# EAGLE design atmega328_tlc5940 (EAGLE 6.4)
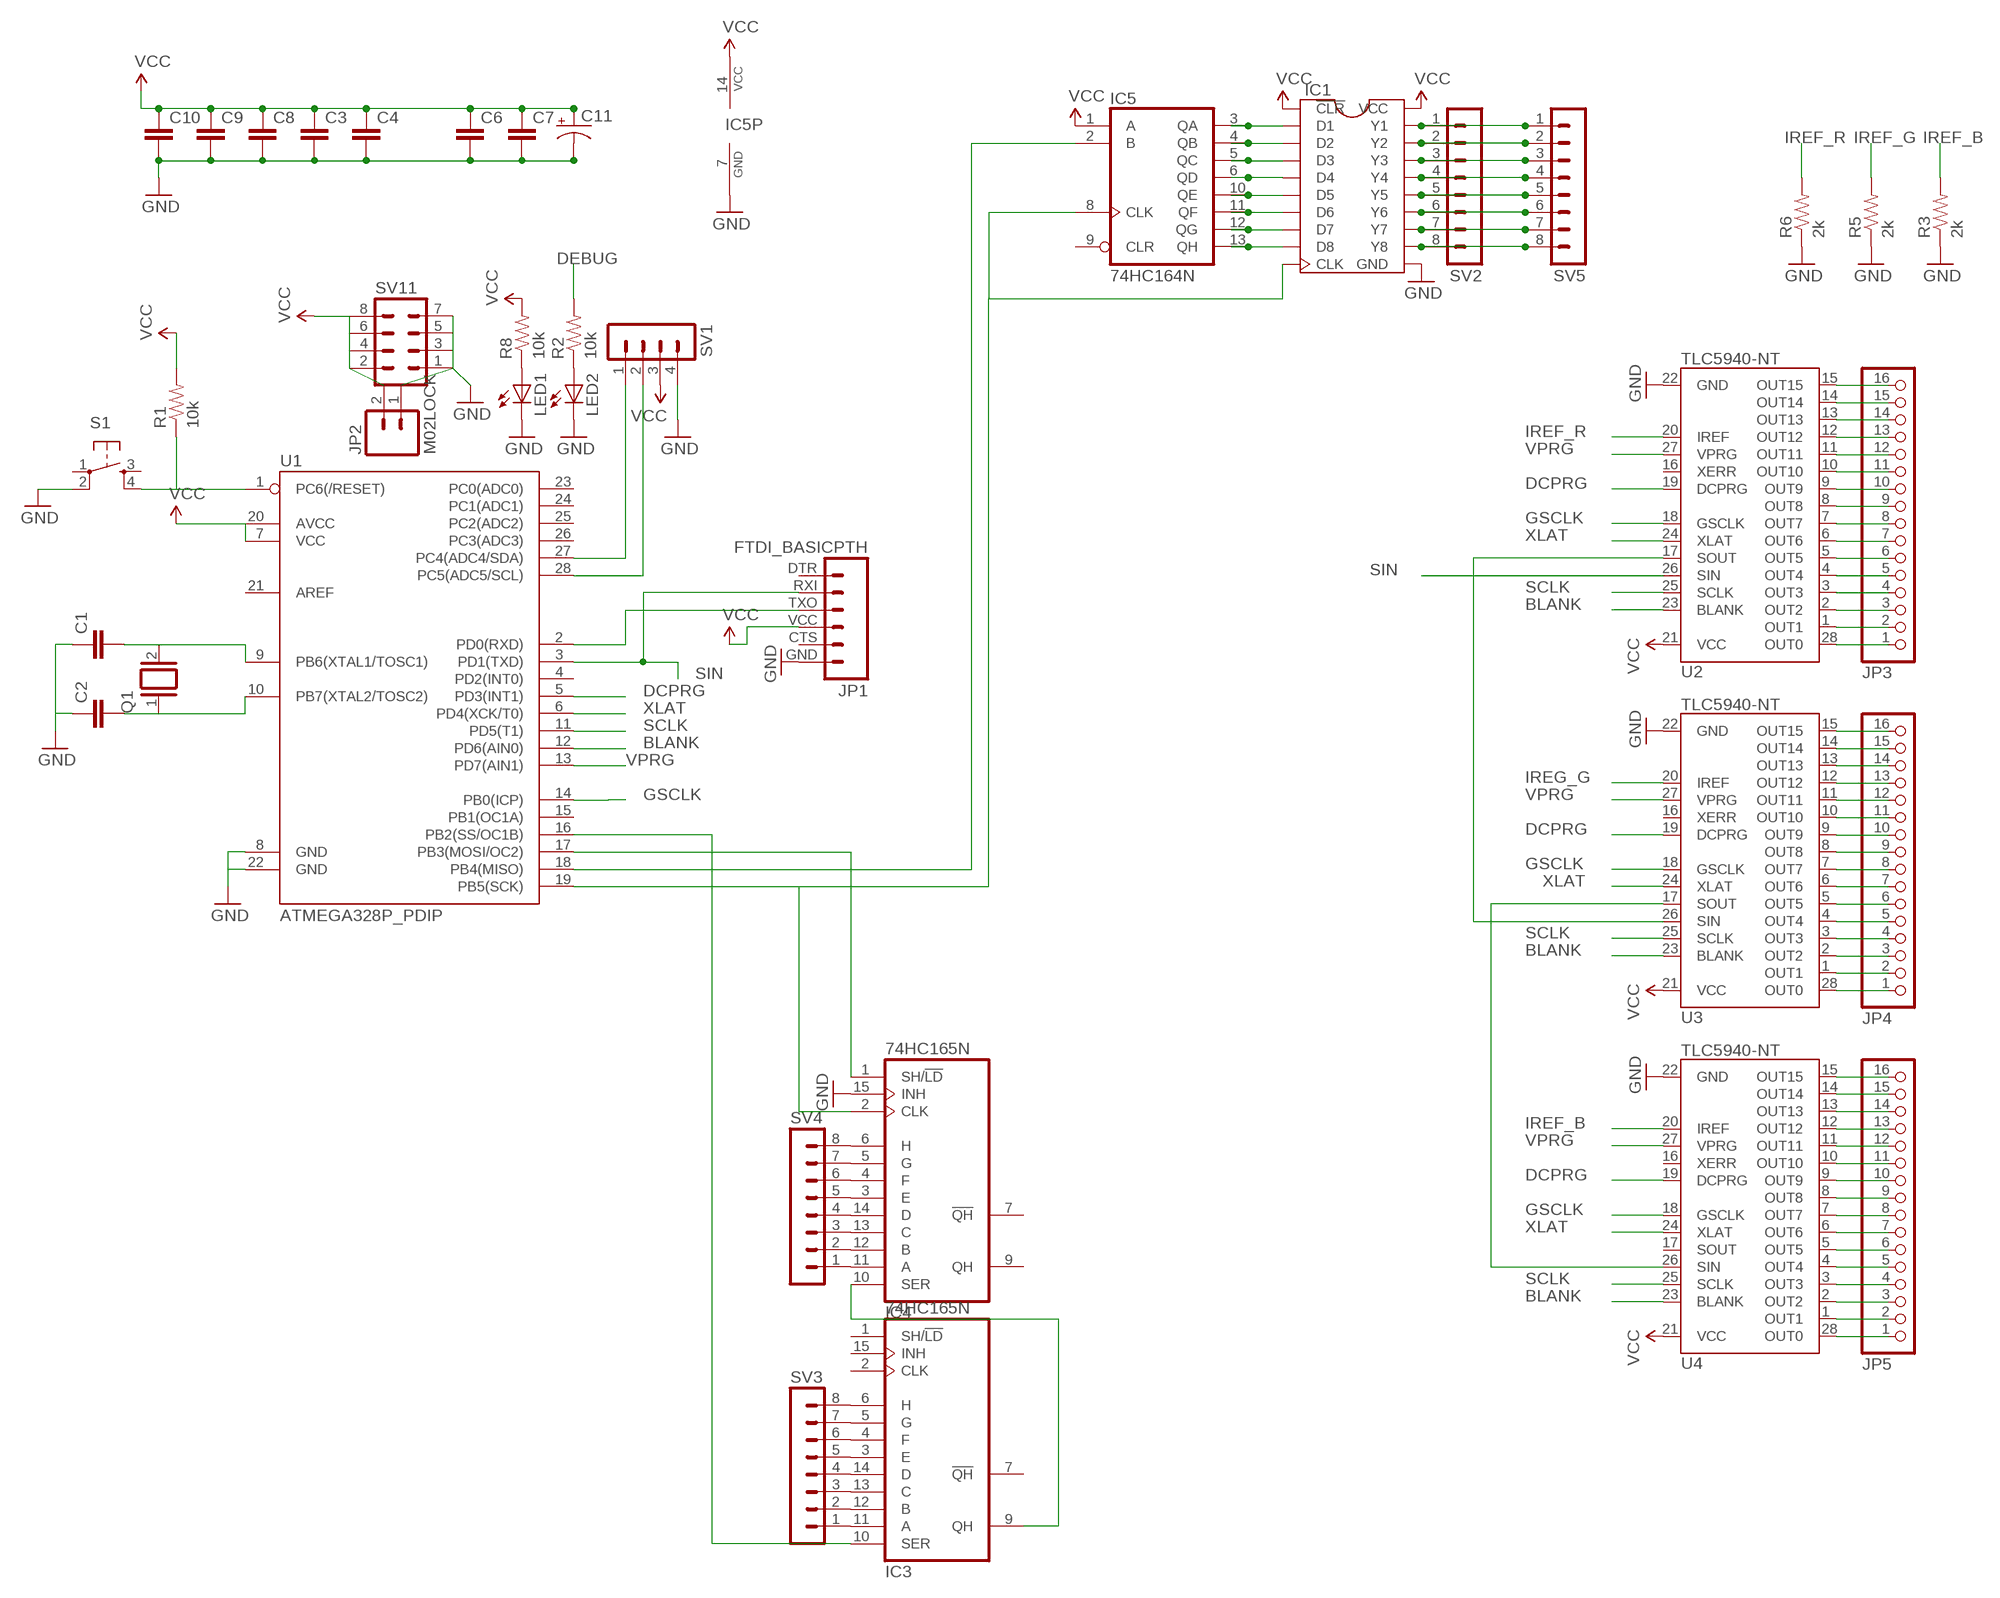
[diagram p0: schematic, sheet 1]

## Parts
C1  CAPEZ  [CAP-PTH-SMALLEZ]
C2  CAPEZ  [CAP-PTH-SMALLEZ]
C3  CAPEZ  [CAP-PTH-SMALLEZ]
C4  CAPEZ  [CAP-PTH-SMALLEZ]
C6  CAPEZ  [CAP-PTH-SMALLEZ]
C7  CAPEZ  [CAP-PTH-SMALLEZ]
C8  CAPEZ  [CAP-PTH-SMALLEZ]
C9  CAPEZ  [CAP-PTH-SMALLEZ]
C10  CAPEZ  [CAP-PTH-SMALLEZ]
C11  CPOL-USE3.5-8  [E3,5-8]
IC1  IC-PACKAGE_DIL20S  [IC-PACKAGE_SOCKET-20]
IC3  74HC165N  [DIL16]
IC4  74HC165N  [DIL16]
IC5  74HC164N  [DIL14]
JP1  FTDI_BASICPTH  [FTDI_BASIC]
JP2  M02LOCK  [1X02_LOCK]
JP3  PINHD-1X16  [1X16]
JP4  PINHD-1X16  [1X16]
JP5  PINHD-1X16  [1X16]
LED1  LED5MM  [LED5MM]
LED2  LED5MM  [LED5MM]
Q1  XTAL/S  [QS]
R1  10k  RESISTORKIT  [AXIAL-0.3-KIT]
R2  10k  RESISTORKIT  [AXIAL-0.3-KIT]
R3  2k  RESISTORKIT  [AXIAL-0.3-KIT]
R5  2k  RESISTORKIT  [AXIAL-0.3-KIT]
R6  2k  RESISTORKIT  [AXIAL-0.3-KIT]
R8  10k  RESISTORKIT  [AXIAL-0.3-KIT]
S1  TAC_SWITCHPTH  [TACTILE-PTH]
SV1  MA04-1  [MA04-1]
SV2  MA08-1  [MA08-1]
SV3  MA08-1  [MA08-1]
SV4  MA08-1  [MA08-1]
SV5  MA08-1  [MA08-1]
SV11  MA04-2  [MA04-2]
U1  ATMEGA328P_PDIP  [DIL28-3]
U2  TLC5940-NT  [DIL28-3]
U3  TLC5940-NT  [DIL28-3]
U4  TLC5940-NT  [DIL28-3]

## Nets
BLANK: U1.12(PD6(AIN0)) U2.23(BLANK) U3.23(BLANK) U4.23(BLANK)
DCPRG: U1.5(PD3(INT1)) U2.19(DCPRG) U3.19(DCPRG) U4.19(DCPRG)
DEBUG: R2.P$2
GND: C1.1 C2.1 C3.2 C4.2 C6.2 C7.2 C8.2 C9.2 C10.2 C11.- IC1.11(GND) IC4.15(INH) IC5.7(GND) JP1.GND JP2.1 LED1.K(C) LED2.K(C) R3.P$1 R5.P$1 R6.P$1 S1.2 SV1.4 SV11.1 SV11.3 SV11.5 SV11.7 U1.8(GND) U1.22(GND) U2.22(GND) U3.22(GND) U4.22(GND)
GSCLK: U1.14(PB0(ICP)) U2.18(GSCLK) U3.18(GSCLK) U4.18(GSCLK)
IREF_B: R3.P$2 U4.20(IREF)
IREF_G: R5.P$2
IREF_R: R6.P$2 U2.20(IREF)
IREG_G: U3.20(IREF)
N$1: R1.P$1 S1.4 U1.1(PC6(/RESET))
N$2: C1.2 Q1.2 U1.9(PB6(XTAL1/TOSC1))
N$3: C2.2 Q1.1 U1.10(PB7(XTAL2/TOSC2))
N$4: JP3.16 U2.15(OUT15)
N$5: JP3.15 U2.14(OUT14)
N$6: JP3.14 U2.13(OUT13)
N$7: JP3.13 U2.12(OUT12)
N$8: JP3.12 U2.11(OUT11)
N$9: JP3.11 U2.10(OUT10)
N$10: JP3.10 U2.9(OUT9)
N$11: JP3.9 U2.8(OUT8)
N$12: JP3.8 U2.7(OUT7)
N$13: JP3.7 U2.6(OUT6)
N$14: JP3.6 U2.5(OUT5)
N$15: JP3.5 U2.4(OUT4)
N$16: JP3.4 U2.3(OUT3)
N$17: JP3.3 U2.2(OUT2)
N$18: JP3.2 U2.1(OUT1)
N$19: JP3.1 U2.28(OUT0)
N$20: JP4.16 U3.15(OUT15)
N$21: JP4.15 U3.14(OUT14)
N$22: JP4.14 U3.13(OUT13)
N$23: SV1.1 U1.27(PC4(ADC4/SDA))
N$24: JP4.13 U3.12(OUT12)
N$25: JP4.12 U3.11(OUT11)
N$26: JP4.11 U3.10(OUT10)
N$27: JP4.10 U3.9(OUT9)
N$28: JP4.9 U3.8(OUT8)
N$29: JP4.8 U3.7(OUT7)
N$30: JP4.7 U3.6(OUT6)
N$31: JP4.6 U3.5(OUT5)
N$32: JP4.5 U3.4(OUT4)
N$33: JP4.4 U3.3(OUT3)
N$34: JP4.3 U3.2(OUT2)
N$35: JP4.2 U3.1(OUT1)
N$36: JP4.1 U3.28(OUT0)
N$37: JP5.16 U4.15(OUT15)
N$38: JP5.15 U4.14(OUT14)
N$39: JP5.14 U4.13(OUT13)
N$40: JP5.13 U4.12(OUT12)
N$41: JP5.12 U4.11(OUT11)
N$42: JP5.11 U4.10(OUT10)
N$43: JP5.10 U4.9(OUT9)
N$44: JP5.9 U4.8(OUT8)
N$45: JP5.8 U4.7(OUT7)
N$46: JP5.7 U4.6(OUT6)
N$47: JP5.6 U4.5(OUT5)
N$48: JP5.5 U4.4(OUT4)
N$49: JP5.4 U4.3(OUT3)
N$50: JP5.3 U4.2(OUT2)
N$51: JP5.2 U4.1(OUT1)
N$52: JP5.1 U4.28(OUT0)
N$53: U2.17(SOUT) U3.26(SIN)
N$54: U3.17(SOUT) U4.26(SIN)
N$55: LED2.A R2.P$1
N$56: LED1.A R8.P$1
N$57: SV1.2 U1.28(PC5(ADC5/SCL))
N$58: IC1.2(D1) IC5.3(QA)
N$59: IC5.2(B) U1.18(PB4(MISO))
N$60: IC1.10(CLK) IC4.2(CLK) IC5.8(CLK) U1.19(PB5(SCK))
N$61: IC4.1(SH/!LD) U1.17(PB3(MOSI/OC2))
N$62: IC1.3(D2) IC5.4(QB)
N$63: IC1.4(D3) IC5.5(QC)
N$64: IC1.5(D4) IC5.6(QD)
N$65: IC1.6(D5) IC5.10(QE)
N$66: IC1.7(D6) IC5.11(QF)
N$67: IC1.8(D7) IC5.12(QG)
N$68: IC1.9(D8) IC5.13(QH)
N$69: IC3.9(QH) IC4.10(SER)
N$70: IC3.10(SER) U1.16(PB2(SS/OC1B))
N$72: IC1.19(Y1) SV2.1 SV5.1
N$73: IC1.18(Y2) SV2.2 SV5.2
N$74: IC1.17(Y3) SV2.3 SV5.3
N$75: IC1.16(Y4) SV2.4 SV5.4
N$76: IC1.15(Y5) SV2.5 SV5.5
N$77: IC1.14(Y6) SV2.6 SV5.6
N$78: IC1.13(Y7) SV2.7 SV5.7
N$79: IC1.12(Y8) SV2.8 SV5.8
N$80: IC3.11(A) SV3.1
N$81: IC3.12(B) SV3.2
N$82: IC3.13(C) SV3.3
N$83: IC3.14(D) SV3.4
N$84: IC3.3(E) SV3.5
N$85: IC3.4(F) SV3.6
N$86: IC3.5(G) SV3.7
N$87: IC3.6(H) SV3.8
N$88: IC4.11(A) SV4.1
N$89: IC4.12(B) SV4.2
N$90: IC4.13(C) SV4.3
N$91: IC4.14(D) SV4.4
N$92: IC4.3(E) SV4.5
N$93: IC4.4(F) SV4.6
N$94: IC4.5(G) SV4.7
N$95: IC4.6(H) SV4.8
RX$0: JP1.TXO U1.2(PD0(RXD))
SCLK: U1.11(PD5(T1)) U2.25(SCLK) U3.25(SCLK) U4.25(SCLK)
SIN: JP1.RXI U1.3(PD1(TXD)) U2.26(SIN)
VCC: C3.1 C4.1 C6.1 C7.1 C8.1 C9.1 C10.1 C11.+ IC1.1(!CLR) IC1.20(VCC) IC5.1(A) IC5.14(VCC) JP1.VCC JP2.2 R1.P$2 R8.P$2 SV1.3 SV11.2 SV11.4 SV11.6 SV11.8 U1.7(VCC) U1.20(AVCC) U2.21(VCC) U3.21(VCC) U4.21(VCC)
VPRG: U1.13(PD7(AIN1)) U2.27(VPRG) U3.27(VPRG) U4.27(VPRG)
XLAT: U1.6(PD4(XCK/T0)) U2.24(XLAT) U3.24(XLAT) U4.24(XLAT)
Unconnected: IC3.1(SH/!LD) IC3.2(CLK) IC3.7(!QH) IC3.15(INH) IC4.7(!QH) IC4.9(QH) IC5.9(CLR) JP1.CTS JP1.DTR S1.1 S1.3 U1.4(PD2(INT0)) U1.15(PB1(OC1A)) U1.21(AREF) U1.23(PC0(ADC0)) U1.24(PC1(ADC1)) U1.25(PC2(ADC2)) U1.26(PC3(ADC3)) U2.16(XERR) U3.16(XERR) U4.16(XERR) U4.17(SOUT)

## Power pins joined to a net without a drawn wire
GND: IC3.8(GND) IC4.8(GND)
VCC: IC3.16(VCC) IC4.16(VCC)

## Library data of the parts
C1 C2 = SparkFun-Passives:CAP: Capacitor Standard 0603 ceramic capacitor, and 0.1" leaded capacitor.
C3 C4 C6-C10 = SparkFun-Capacitors:CAP: Capacitor Standard 0603 ceramic capacitor, and 0.1" leaded capacitor.
C11 = resistor:CPOL-US: POLARIZED CAPACITOR, American symbol
IC1 = TLC59213:IC-PACKAGE_DIL20: Dual In Line / Socket
IC3 IC4 = 74xx-eu:74*165: 8-bit parallel load SHIFT REGISTER
IC5 = 74xx-us:74*164: 8-bit parallel out SHIFT REGISTER
JP1 = SparkFun-Connectors:FTDI_BASIC: FTDI Basic header with labels
JP2 = SparkFun-Connectors:M02: Standard 2-pin 0.1" header. Use with - straight break away headers ( PRT-00116) - right angle break away headers (PRT-00553) - swiss pins (PRT-00743) - machine pins (PRT-00117) - female headers (PRT-00115) Molex polarized connector foot print use with: PRT-08233 with associated crimp pins and housings. 2.54_SCREWTERM for use with PRT-10571. 3.5mm Screw Terminal footprints for PRT-08084 5mm Screw Terminal footprints for use with PRT-08433
JP3-JP5 = pinhead:PINHD-1X16: PIN HEADER
LED1 LED2 = led:LED: LED OSRAM: - CHIPLED LG R971, LG N971, LY N971, LG Q971, LY Q971, LO R971, LY R971 LH N974, LH R974 LS Q976, LO Q976, LY Q976 LO Q996 - Hyper CHIPLED LW Q18S LB Q993, LB Q99A, LB R99A - SideLED LS A670, LO A670, LY A670, LG A670, LP A670 LB A673, LV A673, LT A673, LW A673 LH A674 LY A675 LS A676, LA A676, LO A676, LY A676, LW A676 LS A679, LY A679, LG A679 - Hyper Micro SIDELED® LS Y876, LA Y876, LO Y876, LY Y876 LT Y87S - SmartLED LW L88C, LW L88S LB L89C, LB L89S, LG L890 LS L89K, LO L89K, LY L89K LS L896, LA L896, LO L896, LY L896 - TOPLED LS T670, LO T670, LY T670, LG T670, LP T670 LSG T670, LSP T670, LSY T670, LOP T670, LYG T670 LG T671, LOG T671, LSG T671 LB T673, LV T673, LT T673, LW T673 LH T674 LS T676, LA T676, LO T676, LY T676, LB T676, LH T676, LSB T676, LW T676 LB T67C, LV T67C, LT T67C, LS T67K, LO T67K, LY T67K, LW E67C LS E67B, LA E67B, LO E67B, LY E67B, LB E67C, LV E67C, LT E67C LW T67C LS T679, LY T679, LG T679 LS T770, LO T770, LY T770, LG T770, LP T770 LB T773, LV T773, LT T773, LW T773 LH T774 LS E675, LA E675, LY E675, LS T675 LS T776, LA T776, LO T776, LY T776, LB T776 LHGB T686 LT T68C, LB T68C - Hyper Mini TOPLED® LB M676 - Mini TOPLED Santana® LG M470 LS M47K, LO M47K, LY M47K Source: http://www.osram.convergy.de LUXEON: - LUMILED® LXK2-PW12-R00, LXK2-PW12-S00, LXK2-PW14-U00, LXK2-PW14-V00 LXK2-PM12-R00, LXK2-PM12-S00, LXK2-PM14-U00 LXK2-PE12-Q00, LXK2-PE12-R00, LXK2-PE12-S00, LXK2-PE14-T00, LXK2-PE14-U00 LXK2-PB12-K00, LXK2-PB12-L00, LXK2-PB12-M00, LXK2-PB14-N00, LXK2-PB14-P00, LXK2-PB14-Q00 LXK2-PR12-L00, LXK2-PR12-M00, LXK2-PR14-Q00, LXK2-PR14-R00 LXK2-PD12-Q00, LXK2-PD12-R00, LXK2-PD12-S00 LXK2-PH12-R00, LXK2-PH12-S00 LXK2-PL12-P00, LXK2-PL12-Q00, LXK2-PL12-R00 Source: www.luxeon.com KINGBRIGHT: KA-3528ASYC Source: www.kingbright.com
Q1 = special:XTAL/S: CRYSTAL
R1-R3 R5 R6 R8 = SparkFun-Passives:RESISTOR: Resistor Basic schematic elements and footprints for 0603, 1206, and PTH resistors.
S1 = SparkFun-Electromechanical:TAC_SWITCH: Momentary Switch Button commonly used for reset or general input. Spark Fun Electronics SKU : COM-00097 SMT- SWCH-08247
SV1 = con-lstb:MA04-1: PIN HEADER; OC_FARNELL: unknown; OC_NEWARK: unknown
SV2-SV5 = con-lstb:MA08-1: PIN HEADER; OC_FARNELL: unknown; OC_NEWARK: unknown
SV11 = con-lstb:MA04-2: PIN HEADER; OC_FARNELL: unknown; OC_NEWARK: unknown
U1 = SparkFun-DigitalIC:ATMEGA328P_PDIP: uC used in the Arduino 32kb flash, 1k EEPROM, 2k SRAM This is the through-hole version of this chip.
U2-U4 = SparkFun-DigitalIC:TLC5940: 16-channel LED Driver with Dot Correction and Grayscale PWM Control The TLC5940 is a 16-channel, constant-current sink LED driver. Each channel has an individually adjustable 4096-step grayscale PWM brightness control and a 64-step, constant-current sink (dot correction). The dot correction adjusts the brightness variations between LED channels and other LED drivers. The dot correction data is stored in an integrated EEPROM. Both grayscale control and dot correction are accessible via a serial interface. A single external resistor sets the maximum current value of all 16 channels. Packages: 28-pin HTSSOP 32-pin 5x5mm QFN 28-pin DIP

## Board
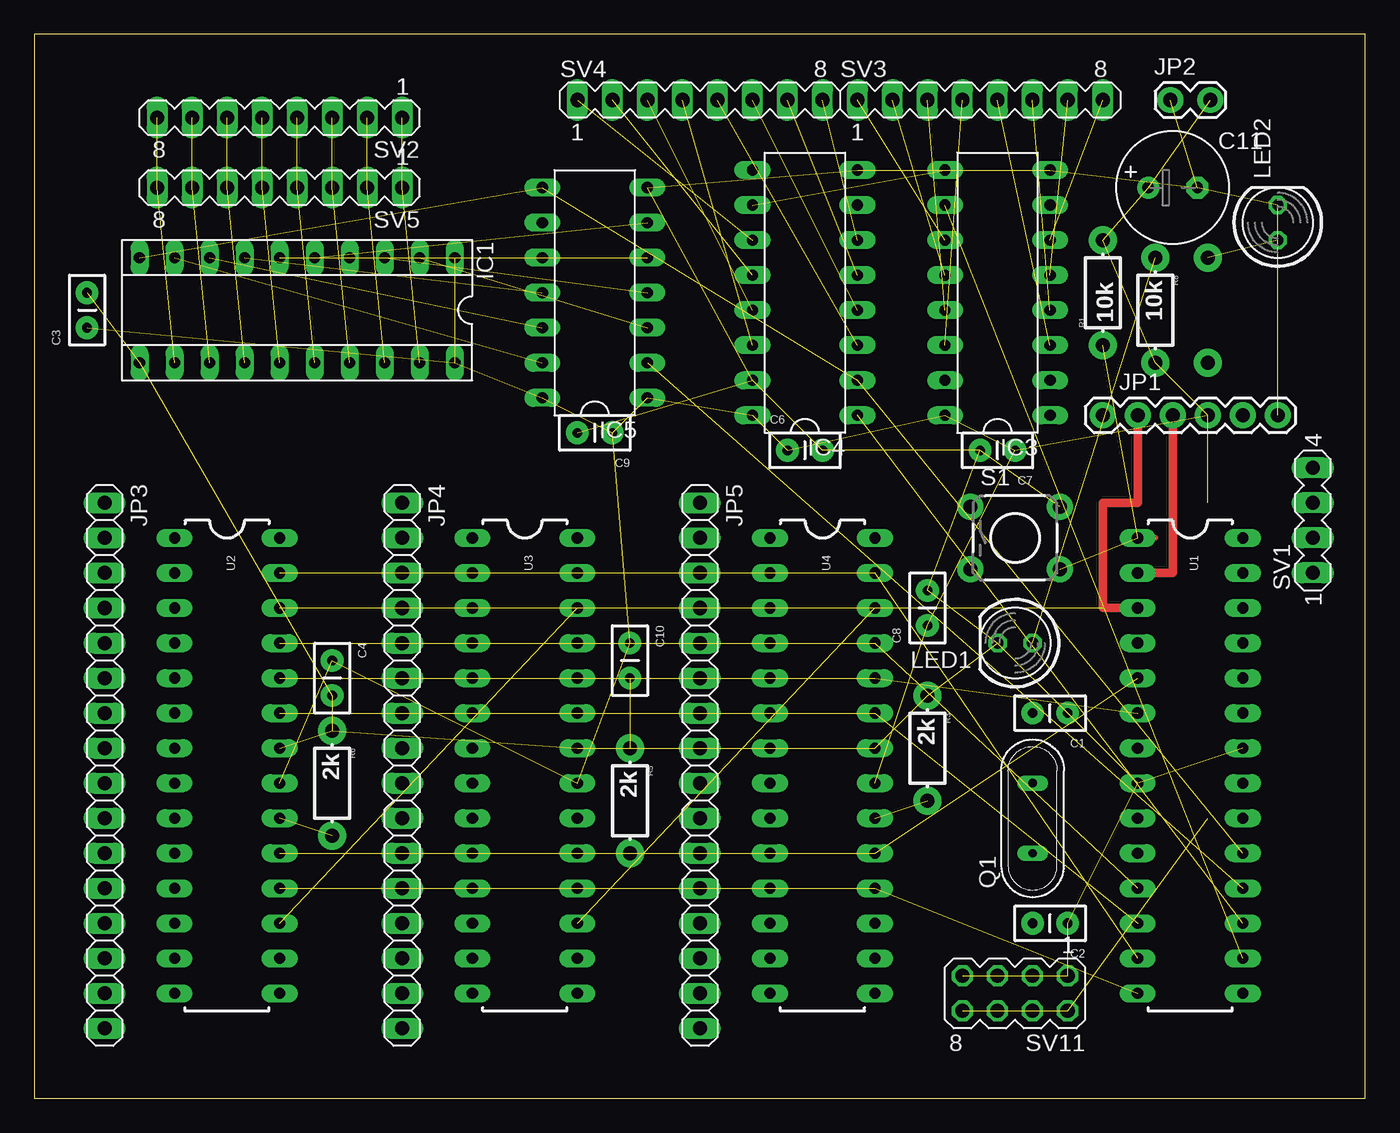
[diagram p1: board, top side]
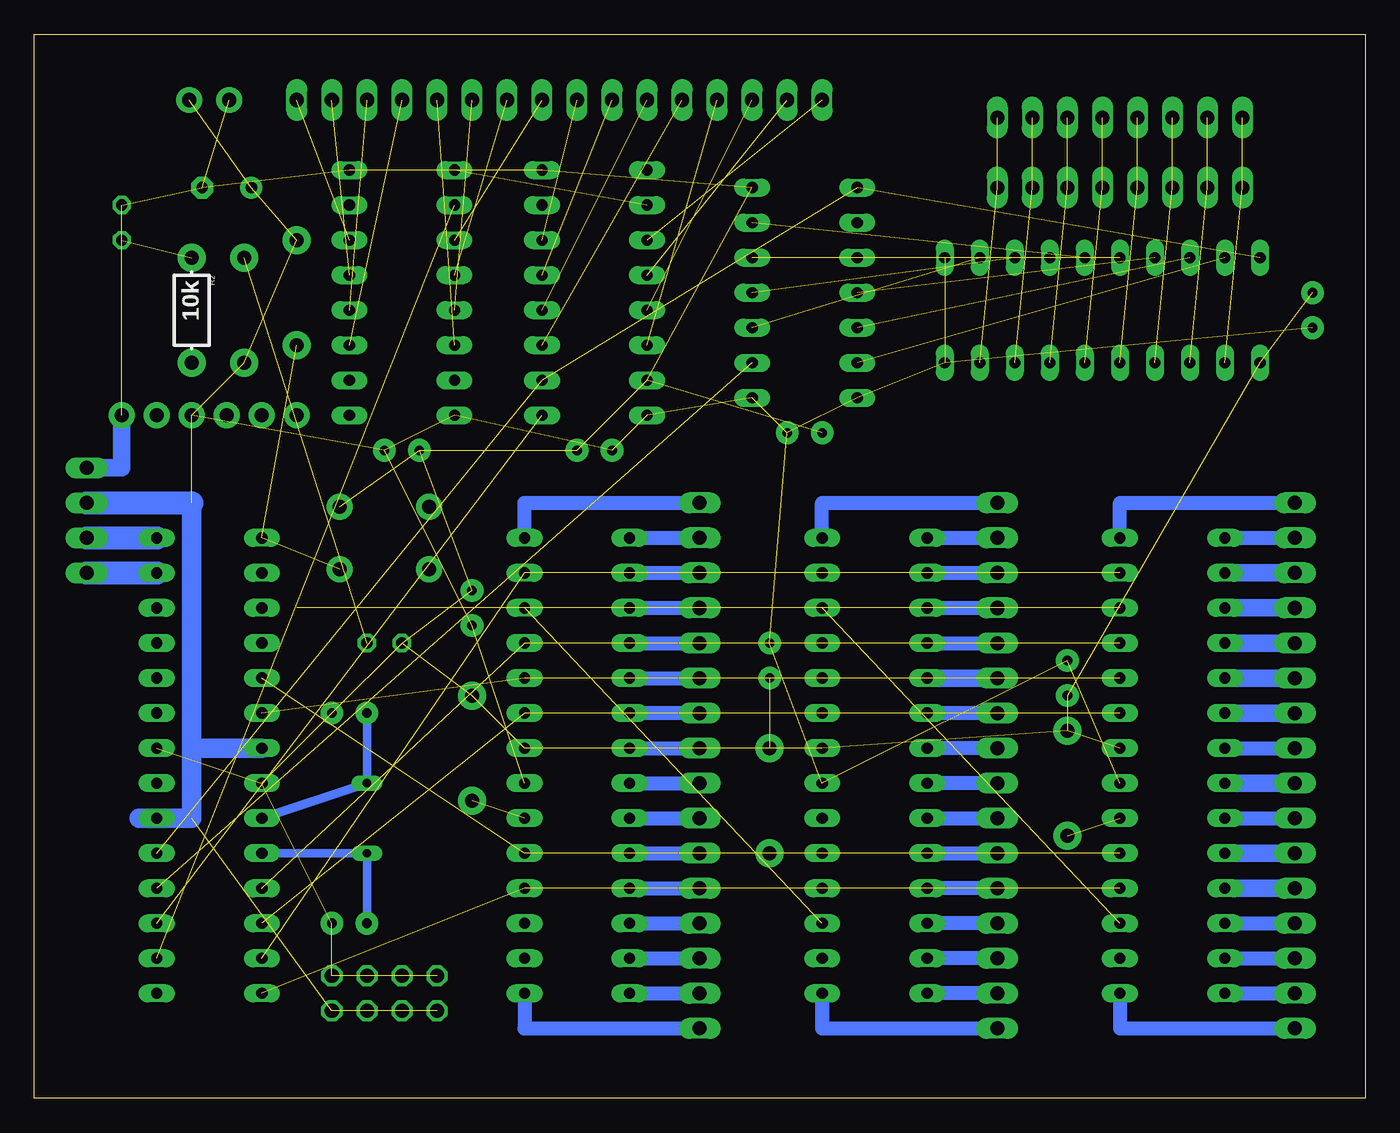
[diagram p2: board, bottom side, seen from below]

Size 96.5 x 77.14 mm. Coordinates in mm from the lower left corner, seen from the top.
Outline: 0,0 96.5,0 96.5,77.14 0,77.14 0,0
Copper layers (1*16): Top 0.035mm / dielectric 1.5mm / Bottom 0.035mm
Design rules "default": minimum track width 10mil, minimum drill 24mil, track to track 8mil, track to pad 8mil, pad to pad 8mil, via to via 8mil, smd to smd 8mil, copper to edge 40mil, drill to drill 8mil, minimum pad ring 10mil, minimum via ring 8mil, stop-mask expansion 4mil, vias tented up to drill 0mil, thermal gap 10mil

### Footprints (pad centres in the part's own frame; a part is rotated, then mirrored left to right if it is on the bottom)
CAP-PTH-SMALLEZ = drill 0.7 pad 1.651: 1 0,0; 2 2.54,0
E3,5-8 = drill 0.813 pad 1.6: + -1.778,0 | drill 0.813 pad 1.6 octagon: - 1.778,0
IC-PACKAGE_SOCKET-20 = drill 0.813 long: 1 -11.43,-3.81; 2 -8.89,-3.81; 3 -6.35,-3.81; 4 -3.81,-3.81; 5 -1.27,-3.81; 6 1.27,-3.81; 7 3.81,-3.81; 8 6.35,-3.81; 9 8.89,-3.81; 10 11.43,-3.81; 11 11.43,3.81; 12 8.89,3.81; 13 6.35,3.81; 14 3.81,3.81; 15 1.27,3.81; 16 -1.27,3.81; 17 -3.81,3.81; 18 -6.35,3.81; 19 -8.89,3.81; 20 -11.43,3.81
DIL16 = drill 0.813 long: 1 -8.89,-3.81; 2 -6.35,-3.81; 3 -3.81,-3.81; 4 -1.27,-3.81; 5 1.27,-3.81; 6 3.81,-3.81; 7 6.35,-3.81; 8 8.89,-3.81; 9 8.89,3.81; 10 6.35,3.81; 11 3.81,3.81; 12 1.27,3.81; 13 -1.27,3.81; 14 -3.81,3.81; 15 -6.35,3.81; 16 -8.89,3.81
DIL14 = drill 0.813 long: 1 -7.62,-3.81; 2 -5.08,-3.81; 3 -2.54,-3.81; 4 0,-3.81; 5 2.54,-3.81; 6 5.08,-3.81; 7 7.62,-3.81; 8 7.62,3.81; 9 5.08,3.81; 10 2.54,3.81; 11 0,3.81; 12 -2.54,3.81; 13 -5.08,3.81; 14 -7.62,3.81
FTDI_BASIC = drill 1.016 pad 1.88: CTS 10.16,0; DTR 0,0; GND 12.7,0; RXI 2.54,0; TXO 5.08,0; VCC 7.62,0
1X02_LOCK = drill 1.016 pad 1.88: 1 -0.178,0; 2 2.718,0
1X16 = drill 1.016 long: 1 -19.05,0; 2 -16.51,0; 3 -13.97,0; 4 -11.43,0; 5 -8.89,0; 6 -6.35,0; 7 -3.81,0; 8 -1.27,0; 9 1.27,0; 10 3.81,0; 11 6.35,0; 12 8.89,0; 13 11.43,0; 14 13.97,0; 15 16.51,0; 16 19.05,0
LED5MM = drill 0.813 octagon: A -1.27,0; K 1.27,0
QS = drill 0.61 long: 1 -2.54,0; 2 2.54,0
AXIAL-0.3-KIT = drill 1.016 pad 2.032: P$1 -3.81,0; P$2 3.81,0
TACTILE-PTH = drill 1.016 pad 1.88: 1 -3.251,2.261; 2 3.251,2.261; 3 -3.251,-2.261; 4 3.251,-2.261
MA04-1 = drill 1.016 long: 1 -3.81,0; 2 -1.27,0; 3 1.27,0; 4 3.81,0
MA08-1 = drill 1.016 long: 1 -8.89,0; 2 -6.35,0; 3 -3.81,0; 4 -1.27,0; 5 1.27,0; 6 3.81,0; 7 6.35,0; 8 8.89,0
MA04-2 = drill 1.016 octagon: 1 -3.81,-1.27; 2 -3.81,1.27; 3 -1.27,-1.27; 4 -1.27,1.27; 5 1.27,-1.27; 6 1.27,1.27; 7 3.81,-1.27; 8 3.81,1.27
DIL28-3 = drill 0.813 long: 1 -16.51,-3.81; 2 -13.97,-3.81; 3 -11.43,-3.81; 4 -8.89,-3.81; 5 -6.35,-3.81; 6 -3.81,-3.81; 7 -1.27,-3.81; 8 1.27,-3.81; 9 3.81,-3.81; 10 6.35,-3.81; 11 8.89,-3.81; 12 11.43,-3.81; 13 13.97,-3.81; 14 16.51,-3.81; 15 16.51,3.81; 16 13.97,3.81; 17 11.43,3.81; 18 8.89,3.81; 19 6.35,3.81; 20 3.81,3.81; 21 1.27,3.81; 22 -1.27,3.81; 23 -3.81,3.81; 24 -6.35,3.81; 25 -8.89,3.81; 26 -11.43,3.81; 27 -13.97,3.81; 28 -16.51,3.81

### Placement (x,y rotation side)
C1  74.93,27.94 180 top
C2  74.93,12.7 180 top
C3  3.81,55.88 90 top
C4  21.59,31.75 270 top
C6  54.61,46.99 0 top
C7  71.12,46.99 180 top
C8  64.77,34.29 90 top
C9  41.91,48.26 180 top
C10  43.18,33.02 270 top
C11  82.55,66.04 0 top
IC1  19.05,57.15 180 top
IC3  69.85,58.42 90 top
IC4  55.88,58.42 90 top
IC5  40.64,58.42 90 top
JP1  77.47,49.53 0 top
JP2  82.55,72.39 0 top
JP3  5.08,24.13 270 top
JP4  26.67,24.13 270 top
JP5  48.26,24.13 270 top
LED1  71.12,33.02 180 top
LED2  90.17,63.5 90 top
Q1  72.39,20.32 90 top
R1  77.47,58.42 90 top
R2  85.09,57.15 270 bottom
R3  64.77,25.4 270 top
R5  43.18,21.59 270 top
R6  21.59,22.86 270 top
R8  81.28,57.15 270 top
S1  71.12,40.64 0 top
SV1  92.71,41.91 90 top
SV2  17.78,71.12 180 top
SV3  68.58,72.39 0 top
SV4  48.26,72.39 0 top
SV5  17.78,66.04 180 top
SV11  71.12,7.62 180 top
U1  83.82,24.13 270 top
U2  13.97,24.13 270 top
U3  35.56,24.13 270 top
U4  57.15,24.13 270 top

### Tracks (layer width: path | path; a pad name or v marks a point on that pad's centre or on a via)
BLANK  (3 unrouted)
DCPRG  (3 unrouted)
GND  (31 unrouted)
  Bottom 1.27: JP1.GND 90.17,45.72 SV1.4
GSCLK  (3 unrouted)
IREF_B  (1 unrouted)
IREF_R  (1 unrouted)
N$1  (2 unrouted)
  Top 0.406: U1.1 81.28,40.64
N$2
  Bottom 0.61: U1.9 Q1.2 C1.2
N$3
  Bottom 0.61: U1.10 Q1.1 C2.2
N$4
  Bottom 1.016: U2.15 17.78,5.08 JP3.16
N$5
  Bottom 1.016: U2.14 JP3.15
N$6
  Bottom 1.016: U2.13 JP3.14
N$7
  Bottom 1.016: U2.12 JP3.13
N$8
  Bottom 1.27: U2.11 JP3.12
N$9
  Bottom 1.27: U2.10 JP3.11
N$10
  Bottom 1.016: U2.9 JP3.10
N$11
  Bottom 1.27: U2.8 JP3.9
N$12
  Bottom 1.016: U2.7 JP3.8
N$13
  Bottom 1.27: JP3.7 U2.6
N$14
  Bottom 1.27: U2.5 JP3.6
N$15
  Bottom 1.27: U2.4 JP3.5
N$16
  Bottom 1.27: JP3.4 U2.3
N$17
  Bottom 1.27: U2.2 JP3.3
N$18
  Bottom 1.016: U2.1 JP3.2
N$19
  Bottom 1.016: U2.28 17.78,43.18 JP3.1
N$20
  Bottom 1.016: U3.15 39.37,5.08 JP4.16
N$21
  Bottom 1.016: JP4.15 U3.14
N$22
  Bottom 1.016: JP4.14 U3.13
N$23
  Bottom 1.676: SV1.1 U1.27
N$24
  Bottom 1.016: JP4.13 U3.12
N$25
  Bottom 1.016: JP4.12 U3.11
N$26
  Bottom 1.016: U3.10 JP4.11
N$27
  Bottom 1.016: U3.9 JP4.10
N$28
  Bottom 1.016: JP4.9 U3.8
N$29
  Bottom 1.016: JP4.8 U3.7
N$30
  Bottom 1.016: JP4.7 U3.6
N$31
  Bottom 1.27: U3.5 JP4.6
N$32
  Bottom 1.016: U3.4 JP4.5
N$33
  Bottom 1.016: U3.3 JP4.4
N$34
  Bottom 1.016: U3.2 JP4.3
N$35
  Bottom 1.016: U3.1 JP4.2
N$36
  Bottom 1.016: U3.28 39.37,43.18 JP4.1
N$37
  Bottom 1.016: U4.15 60.96,5.08 JP5.16
N$38
  Bottom 1.016: U4.14 JP5.15
N$39
  Bottom 1.016: U4.13 JP5.14
N$40
  Bottom 1.016: U4.12 JP5.13
N$41
  Bottom 1.016: U4.11 JP5.12
N$42
  Bottom 1.016: U4.10 JP5.11
N$43
  Bottom 1.016: U4.9 JP5.10
N$44
  Bottom 1.016: U4.8 JP5.9
N$45
  Bottom 1.016: U4.7 JP5.8
N$46
  Bottom 1.016: JP5.7 U4.6
N$47
  Bottom 1.016: U4.5 JP5.6
N$48
  Bottom 1.016: U4.4 JP5.5
N$49
  Bottom 1.016: U4.3 JP5.4
N$50
  Bottom 1.016: U4.2 JP5.3
N$51
  Bottom 1.016: U4.1 JP5.2
N$52
  Bottom 1.016: U4.28 60.96,43.18 JP5.1
N$53  (1 unrouted)
N$54  (1 unrouted)
N$55  (1 unrouted)
N$56  (1 unrouted)
N$57
  Bottom 1.676: SV1.2 U1.28
N$58  (1 unrouted)
N$59  (1 unrouted)
N$60  (3 unrouted)
N$61  (1 unrouted)
N$62  (1 unrouted)
N$63  (1 unrouted)
N$64  (1 unrouted)
N$65  (1 unrouted)
N$66  (1 unrouted)
N$67  (1 unrouted)
N$68  (1 unrouted)
N$69  (1 unrouted)
N$70  (1 unrouted)
N$72  (2 unrouted)
N$73  (2 unrouted)
N$74  (2 unrouted)
N$75  (2 unrouted)
N$76  (2 unrouted)
N$77  (2 unrouted)
N$78  (2 unrouted)
N$79  (2 unrouted)
N$80  (1 unrouted)
N$81  (1 unrouted)
N$82  (1 unrouted)
N$83  (1 unrouted)
N$84  (1 unrouted)
N$85  (1 unrouted)
N$86  (1 unrouted)
N$87  (1 unrouted)
N$88  (1 unrouted)
N$89  (1 unrouted)
N$90  (1 unrouted)
N$91  (1 unrouted)
N$92  (1 unrouted)
N$93  (1 unrouted)
N$94  (1 unrouted)
N$95  (1 unrouted)
RX$0
  Top 0.61: JP1.TXO 82.55,38.1 U1.2
SCLK  (3 unrouted)
SIN  (1 unrouted)
  Top 0.61: JP1.RXI 80.01,43.18 77.47,43.18 77.47,35.56 U1.3
VCC  (25 unrouted)
  Bottom 1.422: 88.9,20.32 U1.20 85.09,20.32 85.09,25.4 | 85.09,43.18 85.09,25.4 | 85.09,25.4 U1.7
  Bottom 1.676: SV1.3 85.09,43.18
VPRG  (3 unrouted)
XLAT  (3 unrouted)